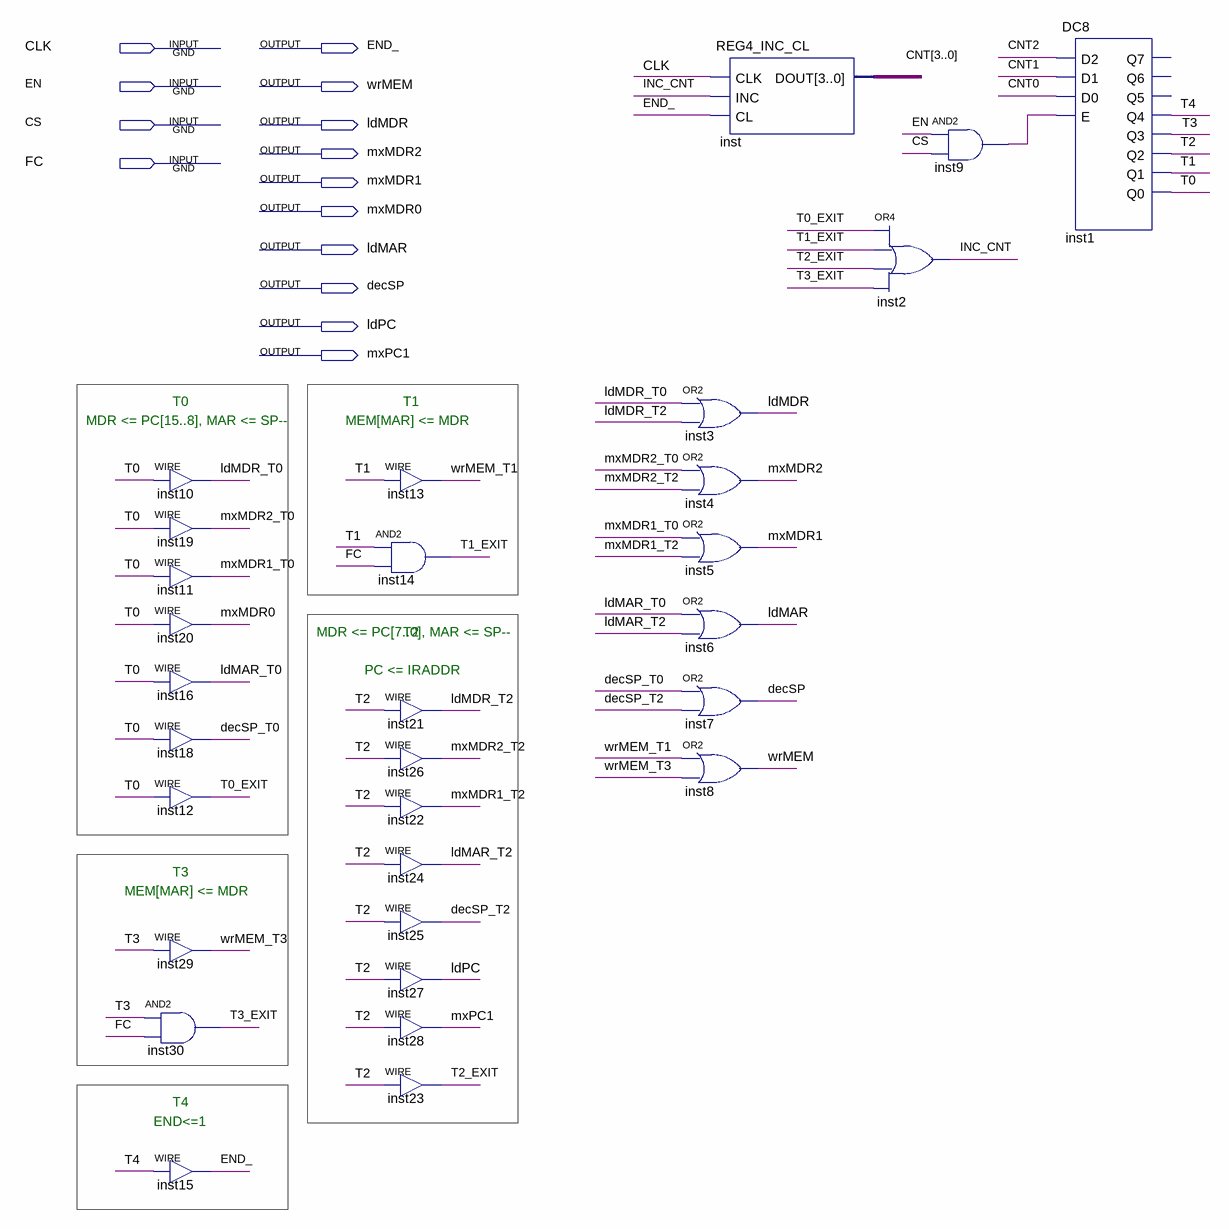
[diagram p0: schematic sheet]
// Quartus schematic JSR.bdf as structural Verilog: 30 symbols, 14 pins
module JSR (
  input  CLK,
  input  EN,
  input  CS,
  input  FC,
  output END_,
  output wrMEM,
  output ldMDR,
  output mxMDR2,
  output mxMDR1,
  output mxMDR0,
  output ldMAR,
  output decSP,
  output ldPC,
  output mxPC1
);

  wire decSP_T0, decSP_T2, INC_CNT, inst9_out, ldMAR_T0, ldMAR_T2, ldMDR_T0, ldMDR_T2, mxMDR1_T0, mxMDR1_T2,
       mxMDR2_T0, mxMDR2_T2, T0, T0_EXIT, T1, T1_EXIT, T2, T2_EXIT, T3, T3_EXIT, T4, wrMEM_T1, wrMEM_T3;
  wire [3:0] CNT;

  assign ldMDR_T0 = T0;  // WIRE inst10
  assign mxMDR2_T0 = T0;  // WIRE inst19
  assign mxMDR1_T0 = T0;  // WIRE inst11
  assign mxMDR0 = T0;  // WIRE inst20
  assign ldMAR_T0 = T0;  // WIRE inst16
  assign decSP_T0 = T0;  // WIRE inst18
  assign T0_EXIT = T0;  // WIRE inst12
  assign wrMEM_T3 = T3;  // WIRE inst29
  and inst30 (T3_EXIT, T3, FC);
  assign END_ = T4;  // WIRE inst15
  assign wrMEM_T1 = T1;  // WIRE inst13
  and inst14 (T1_EXIT, T1, FC);
  assign ldMDR_T2 = T2;  // WIRE inst21
  assign mxMDR2_T2 = T2;  // WIRE inst26
  assign mxMDR1_T2 = T2;  // WIRE inst22
  assign ldMAR_T2 = T2;  // WIRE inst24
  assign decSP_T2 = T2;  // WIRE inst25
  assign ldPC = T2;  // WIRE inst27
  assign mxPC1 = T2;  // WIRE inst28
  assign T2_EXIT = T2;  // WIRE inst23
  REG4_INC_CL inst (.CLK(CLK), .INC(INC_CNT), .CL(END_), .DOUT(CNT));
  or inst3 (ldMDR, ldMDR_T0, ldMDR_T2);
  or inst4 (mxMDR2, mxMDR2_T0, mxMDR2_T2);
  or inst5 (mxMDR1, mxMDR1_T0, mxMDR1_T2);
  or inst6 (ldMAR, ldMAR_T0, ldMAR_T2);
  or inst7 (decSP, decSP_T0, decSP_T2);
  or inst8 (wrMEM, wrMEM_T1, wrMEM_T3);
  or inst2 (INC_CNT, T0_EXIT, T1_EXIT, T2_EXIT, T3_EXIT);
  and inst9 (inst9_out, EN, CS);
  DC8 inst1 (
    .D2(CNT[2]), .D1(CNT[1]), .D0(CNT[0]), .E(inst9_out), .Q4(T4), .Q3(T3), .Q2(T2), .Q1(T1), .Q0(T0));  // open: Q7, Q6, Q5

  // Notes on the sheet:
  //   T0
  //   T1
  //   MDR <= PC[15..8], MAR <= SP--
  //   MEM[MAR] <= MDR
  //   MDR <= PC[7..0], MAR <= SP--
  //   T2
  //   PC <= IRADDR
  //   T3
  //   MEM[MAR] <= MDR
  //   T4
  //   END<=1
endmodule
